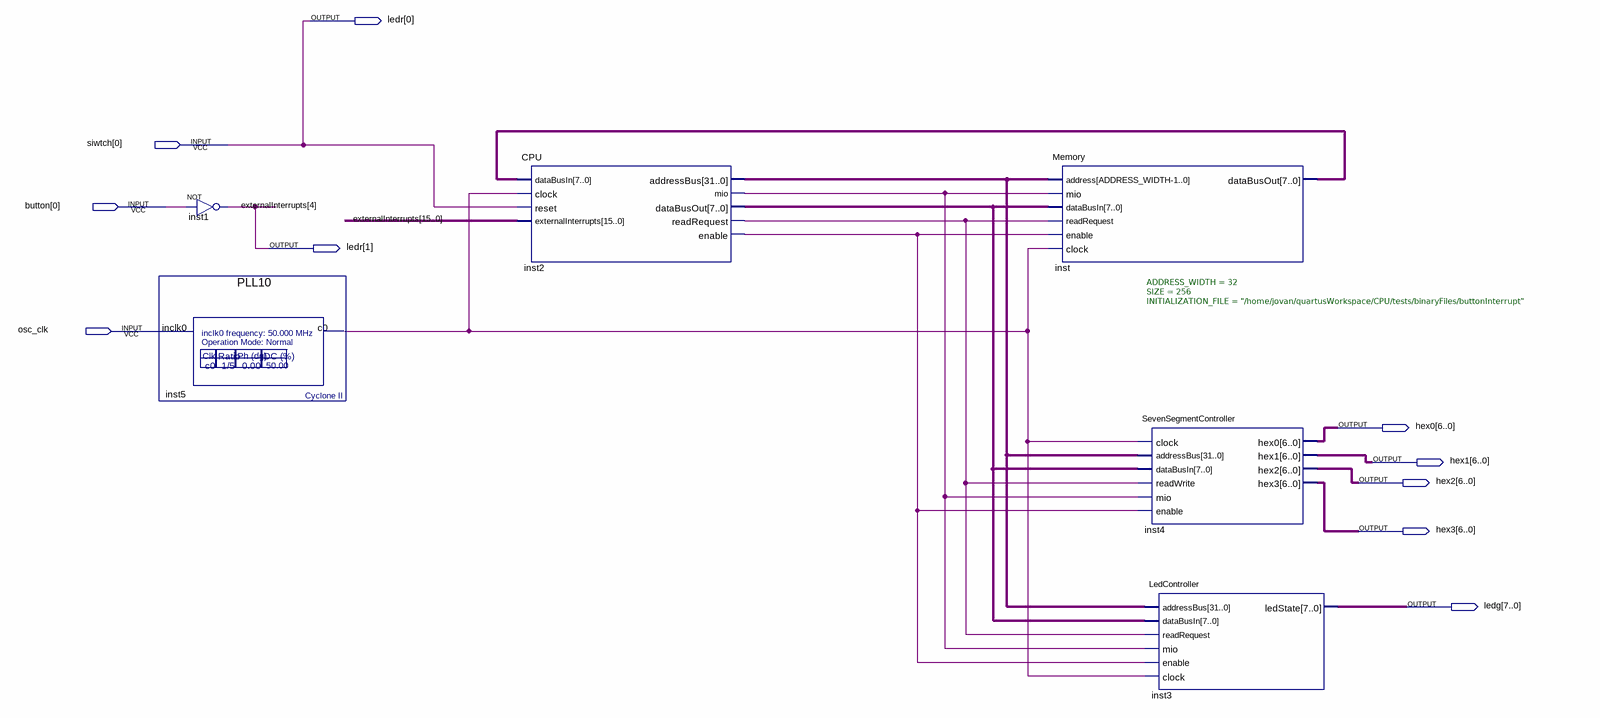
[diagram p0: schematic sheet]
// Quartus schematic top.bdf as structural Verilog: 6 symbols, 10 pins
module top (
  input  [0:0] siwtch,
  input  [0:0] button,
  input  osc_clk,
  output [1:0] ledr,
  output [6:0] hex0,
  output [6:0] hex1,
  output [6:0] hex2,
  output [6:0] hex3,
  output [7:0] ledg
);

  wire inst2_enable, inst2_mio, inst2_readrequest, inst5_c0;
  wire [7:0] inst2_databusout, inst_databusout;
  wire [15:0] externalInterrupts;
  wire [31:0] inst2_addressbus;

  not inst1 (ledr[1], button[0]);
  PLL10 inst5 (.inclk0(osc_clk), .c0(inst5_c0));
  CPU inst2 (
    .dataBusIn(inst_databusout), .clock(inst5_c0), .reset(siwtch[0]),
    .externalInterrupts({externalInterrupts[15:5], ledr[1], externalInterrupts[3:0]}),
    .addressBus(inst2_addressbus), .mio(inst2_mio), .dataBusOut(inst2_databusout),
    .readRequest(inst2_readrequest), .enable(inst2_enable));
  Memory #(.ADDRESS_WIDTH(32), .SIZE(256), .INITIALIZATION_FILE("/home/jovan/quartusWorkspace/CPU/tests/binaryFiles/buttonInterrupt")) inst (
    .address(inst2_addressbus), .mio(inst2_mio), .dataBusIn(inst2_databusout),
    .readRequest(inst2_readrequest), .enable(inst2_enable), .clock(inst5_c0), .dataBusOut(inst_databusout));
  SevenSegmentController inst4 (
    .clock(inst5_c0), .addressBus(inst2_addressbus), .dataBusIn(inst2_databusout),
    .readWrite(inst2_readrequest), .mio(inst2_mio), .enable(inst2_enable), .hex0(hex0), .hex1(hex1),
    .hex2(hex2), .hex3(hex3));
  LedController inst3 (
    .addressBus(inst2_addressbus), .dataBusIn(inst2_databusout), .readRequest(inst2_readrequest),
    .mio(inst2_mio), .enable(inst2_enable), .clock(inst5_c0), .ledState(ledg));

  assign ledr[0] = siwtch[0];

  // Other names for the same wires on the sheet: externalInterrupts[4] = ledr[1]
endmodule
